# Altium schematic sheet BM78SPP05NC2.SchDoc
size A4; Organization: Altium Limited; Address1: L3, 12a Rodborough Rd; Address2: Frenchs Forest; Address3: NSW; Address4: Australia 2086
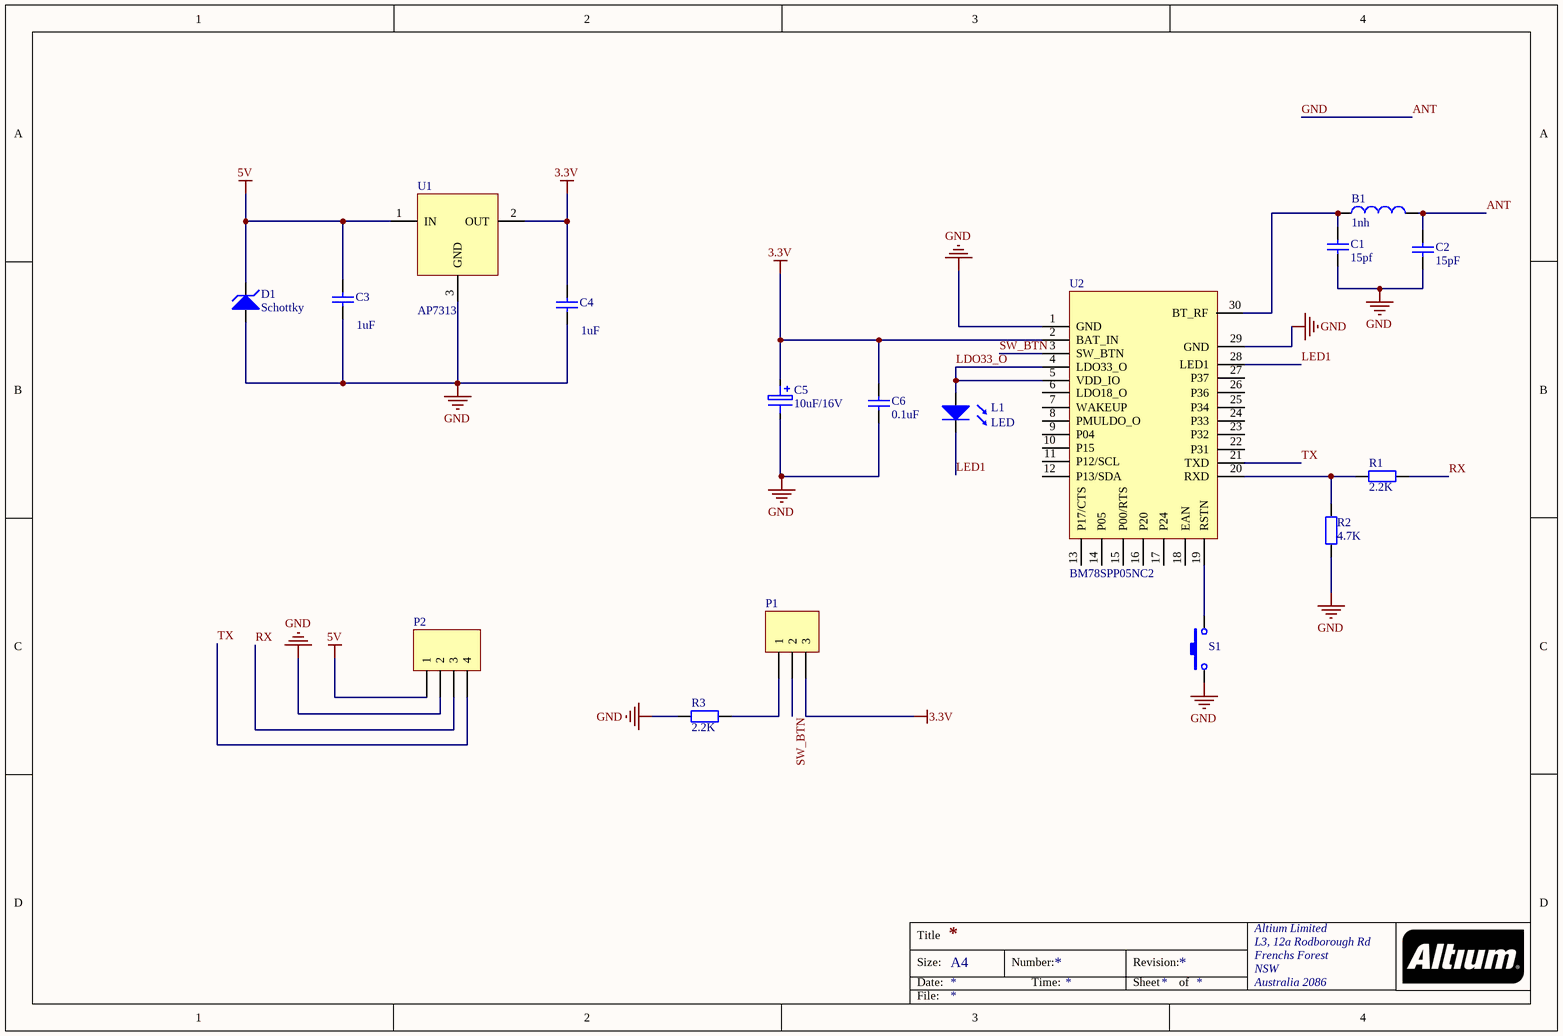
[diagram p0: BM78SPP05NC2.SchDoc]

## Parts
B1  1nh  [0603]
C1  15pf  [0603]
C2  15pF  [0603]
C3  1uF  [0603]
C4  1uF  [0603]
C5  10uF/16V  [1206]
C6  0.1uF  [0603]
D1  Schottky  [DO214-AC]
L1  LED  [0805]
P1  HC-SR501  [Header3]  (value not drawn)
P2  Header 4  [HDR1X4]  (value not drawn)
R1  2.2K  [0603]
R2  4.7K  [0603]
R3  2.2K  [0603]
S1  Button  [BUtton-T4]  (value not drawn)
U1  AP7313  [AP7313-33SAG-7]
U2  BM78SPP05NC2  [BM78SPP05NC2]

## Nets
3.3V: C4.2 C5.1 C6.1 P1.3 U1.2(OUT) U2.2(BAT_IN)
5V: C3.2 D1.2(K) P2.1 U1.1(IN)
ANT: B1.2 C1.1 C2.1 C2.2 C3.1 C4.1 C5.2 C6.2 D1.1(A) P2.2 R2.1 R3.1 S1.1 U1.3(GND) U2.1(GND) U2.29(GND)  [also labelled GND]
LDO33_O: L1.1(A) U2.4(LDO33_O) U2.5(VDD_IO)
LED1: L1.2(K) U2.28(LED1)
RX: P2.3 R1.1
SW_BTN: P1.2 U2.3(SW_BTN)
TX: P2.4 U2.21(TXD)
NetB1_1: B1.1 C1.2 U2.30(BT_RF)
NetP1_1: P1.1 R3.2
NetR1_2: R1.2 R2.2 U2.20(RXD)
NetS1_2: S1.2 U2.19(RSTN)

Not connected (* = marked no-connect by the designer): U2 6(LDO18_O) 7(WAKEUP) 8(PMULDO_O) 9(P04) 10(P15) 11(P12/SCL) 12(P13/SDA) 13(P17/CTS) 14(P05) 15(P00/RTS) 16(P20) 17(P24) 18(EAN) 22(P31) 23(P32) 24(P33) 25(P34) 26(P36) 27(P37)

## Notes on the sheet
- Title
- Size:
- Date:
- A4
- Number:
- Time:
- Revision:
- Sheet
- of
- File:

## Library data of the parts
B1 = Bead
C1-C4 C6 = Cap1: ceramic
C5 = Cap3: aluminum
D1 = B340A-13-F
P1 = Header 3: Header, 3-Pin; LatestRevisionDate: 17-Jul-2002; LatestRevisionNote: Re-released for DXP Platform.; Publisher: Altium Limited
P2 = Header 4: Header, 4-Pin; LatestRevisionDate: 17-Jul-2002; LatestRevisionNote: Re-released for DXP Platform.; Publisher: Altium Limited
R1-R3 = Res
U1 = AP7313-33SAG-7